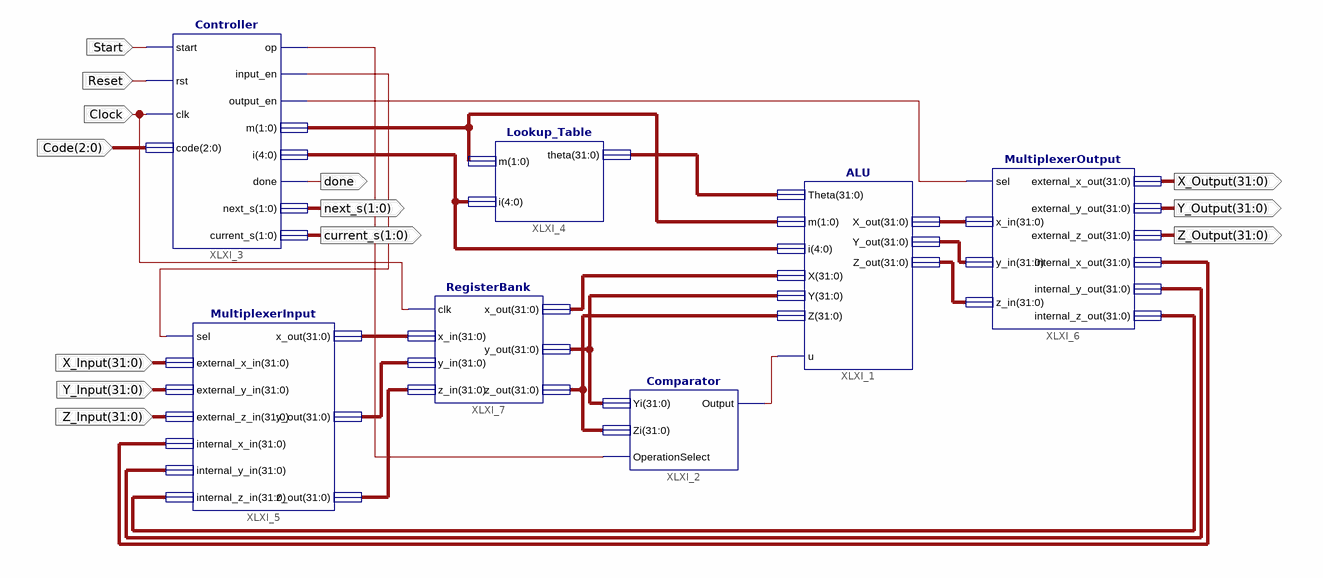
[diagram p0: schematic sheet 1]
// Xilinx ISE schematic SystemSchematic.sch (spartan3e) as structural Verilog: 7 symbols, 13 ports
module SystemSchematic (
  input  [31:0] X_Input,
  input  [31:0] Y_Input,
  input  [31:0] Z_Input,
  input  Start,
  input  Reset,
  input  Clock,
  input  [2:0] Code,
  output [31:0] X_Output,
  output [31:0] Y_Output,
  output [31:0] Z_Output,
  output done,
  output [1:0] next_s,
  output [1:0] current_s
);

  wire InputEn, OP, output_en, u;
  wire [1:0] m;
  wire [4:0] i;
  wire [31:0] ALUOutX, ALUOutY, ALUOutZ, MuxInX, MuxInY, MuxInZ, MuxOutX, MuxOutY, MuxOutZ, RegisterX,
       RegisterY, RegisterZ, Theta;

  Comparator XLXI_2 (.OperationSelect(OP), .Zi(RegisterZ), .Yi(RegisterY), .Output(u));
  Controller XLXI_3 (
    .start(Start), .rst(Reset), .clk(Clock), .code(Code), .op(OP), .input_en(InputEn), .output_en(output_en),
    .done(done), .m(m), .i(i), .next_s(next_s), .current_s(current_s));
  Lookup_Table XLXI_4 (.i(i), .m(m), .theta(Theta));
  MultiplexerInput XLXI_5 (
    .sel(InputEn), .external_x_in(X_Input), .external_y_in(Y_Input), .external_z_in(Z_Input),
    .internal_x_in(MuxOutX), .internal_y_in(MuxOutY), .internal_z_in(MuxOutZ), .x_out(MuxInX),
    .y_out(MuxInY), .z_out(MuxInZ));
  RegisterBank XLXI_7 (
    .clk(Clock), .x_in(MuxInX), .y_in(MuxInY), .z_in(MuxInZ), .x_out(RegisterX), .y_out(RegisterY),
    .z_out(RegisterZ));
  ALU XLXI_1 (
    .m(m), .X_out(ALUOutX), .Y_out(ALUOutY), .Z_out(ALUOutZ), .u(u), .Theta(Theta), .Z(RegisterZ), .i(i),
    .X(RegisterX), .Y(RegisterY));
  MultiplexerOutput XLXI_6 (
    .sel(output_en), .x_in(ALUOutX), .y_in(ALUOutY), .z_in(ALUOutZ), .external_x_out(X_Output),
    .external_y_out(Y_Output), .external_z_out(Z_Output), .internal_x_out(MuxOutX), .internal_z_out(MuxOutZ),
    .internal_y_out(MuxOutY));
endmodule
